# EAGLE board MakerBot_MightyBoard_REVE (EAGLE 5.11), part 1 of 2
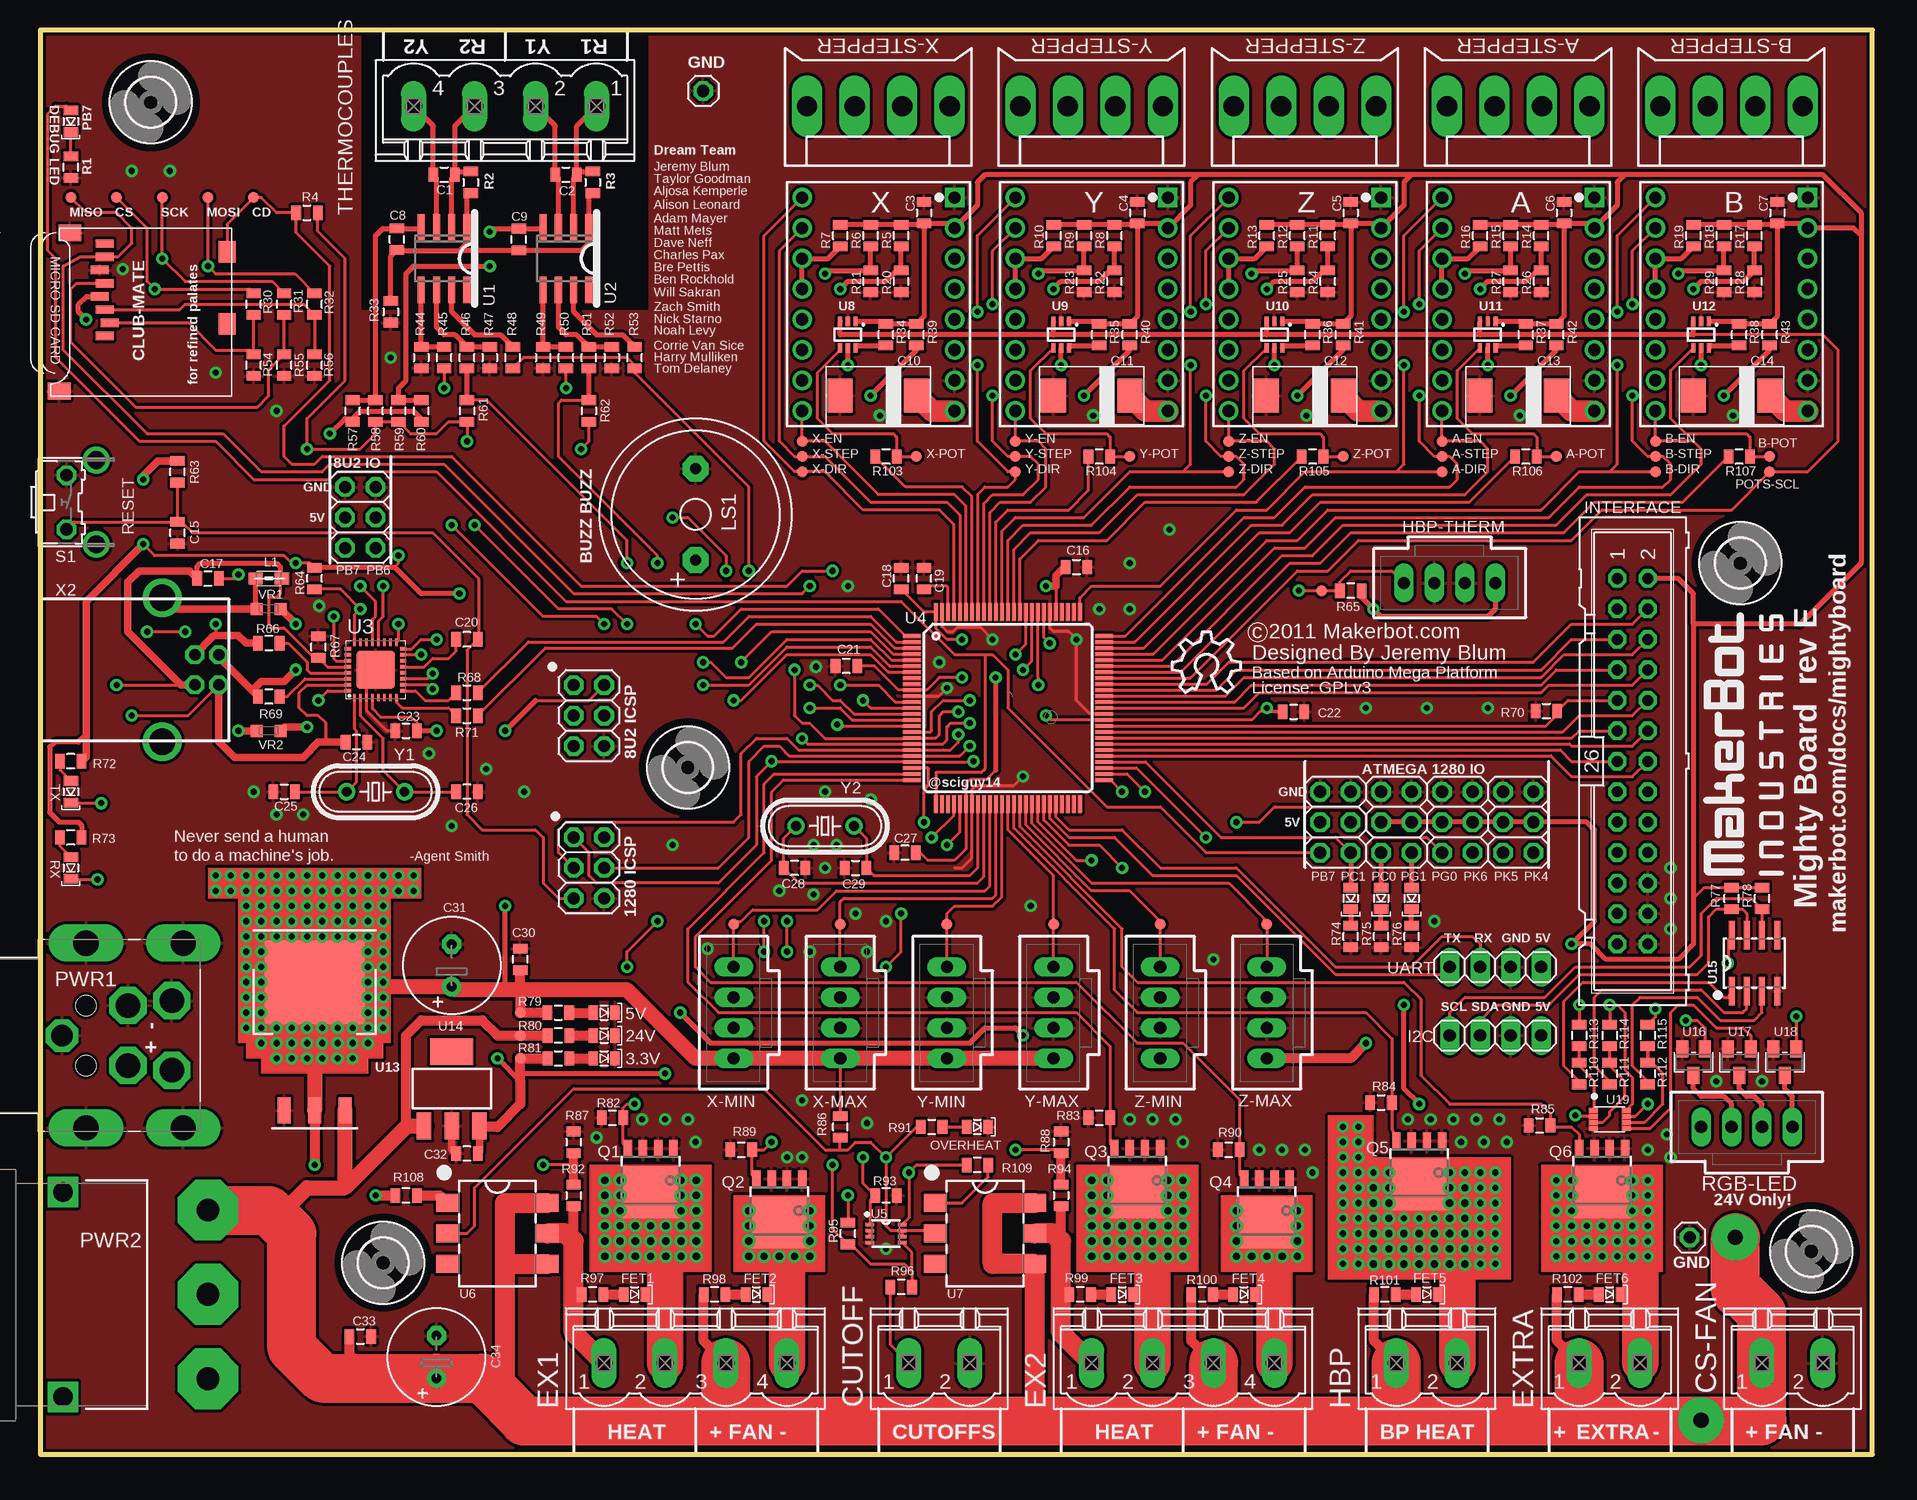
[diagram p2: board, top side]
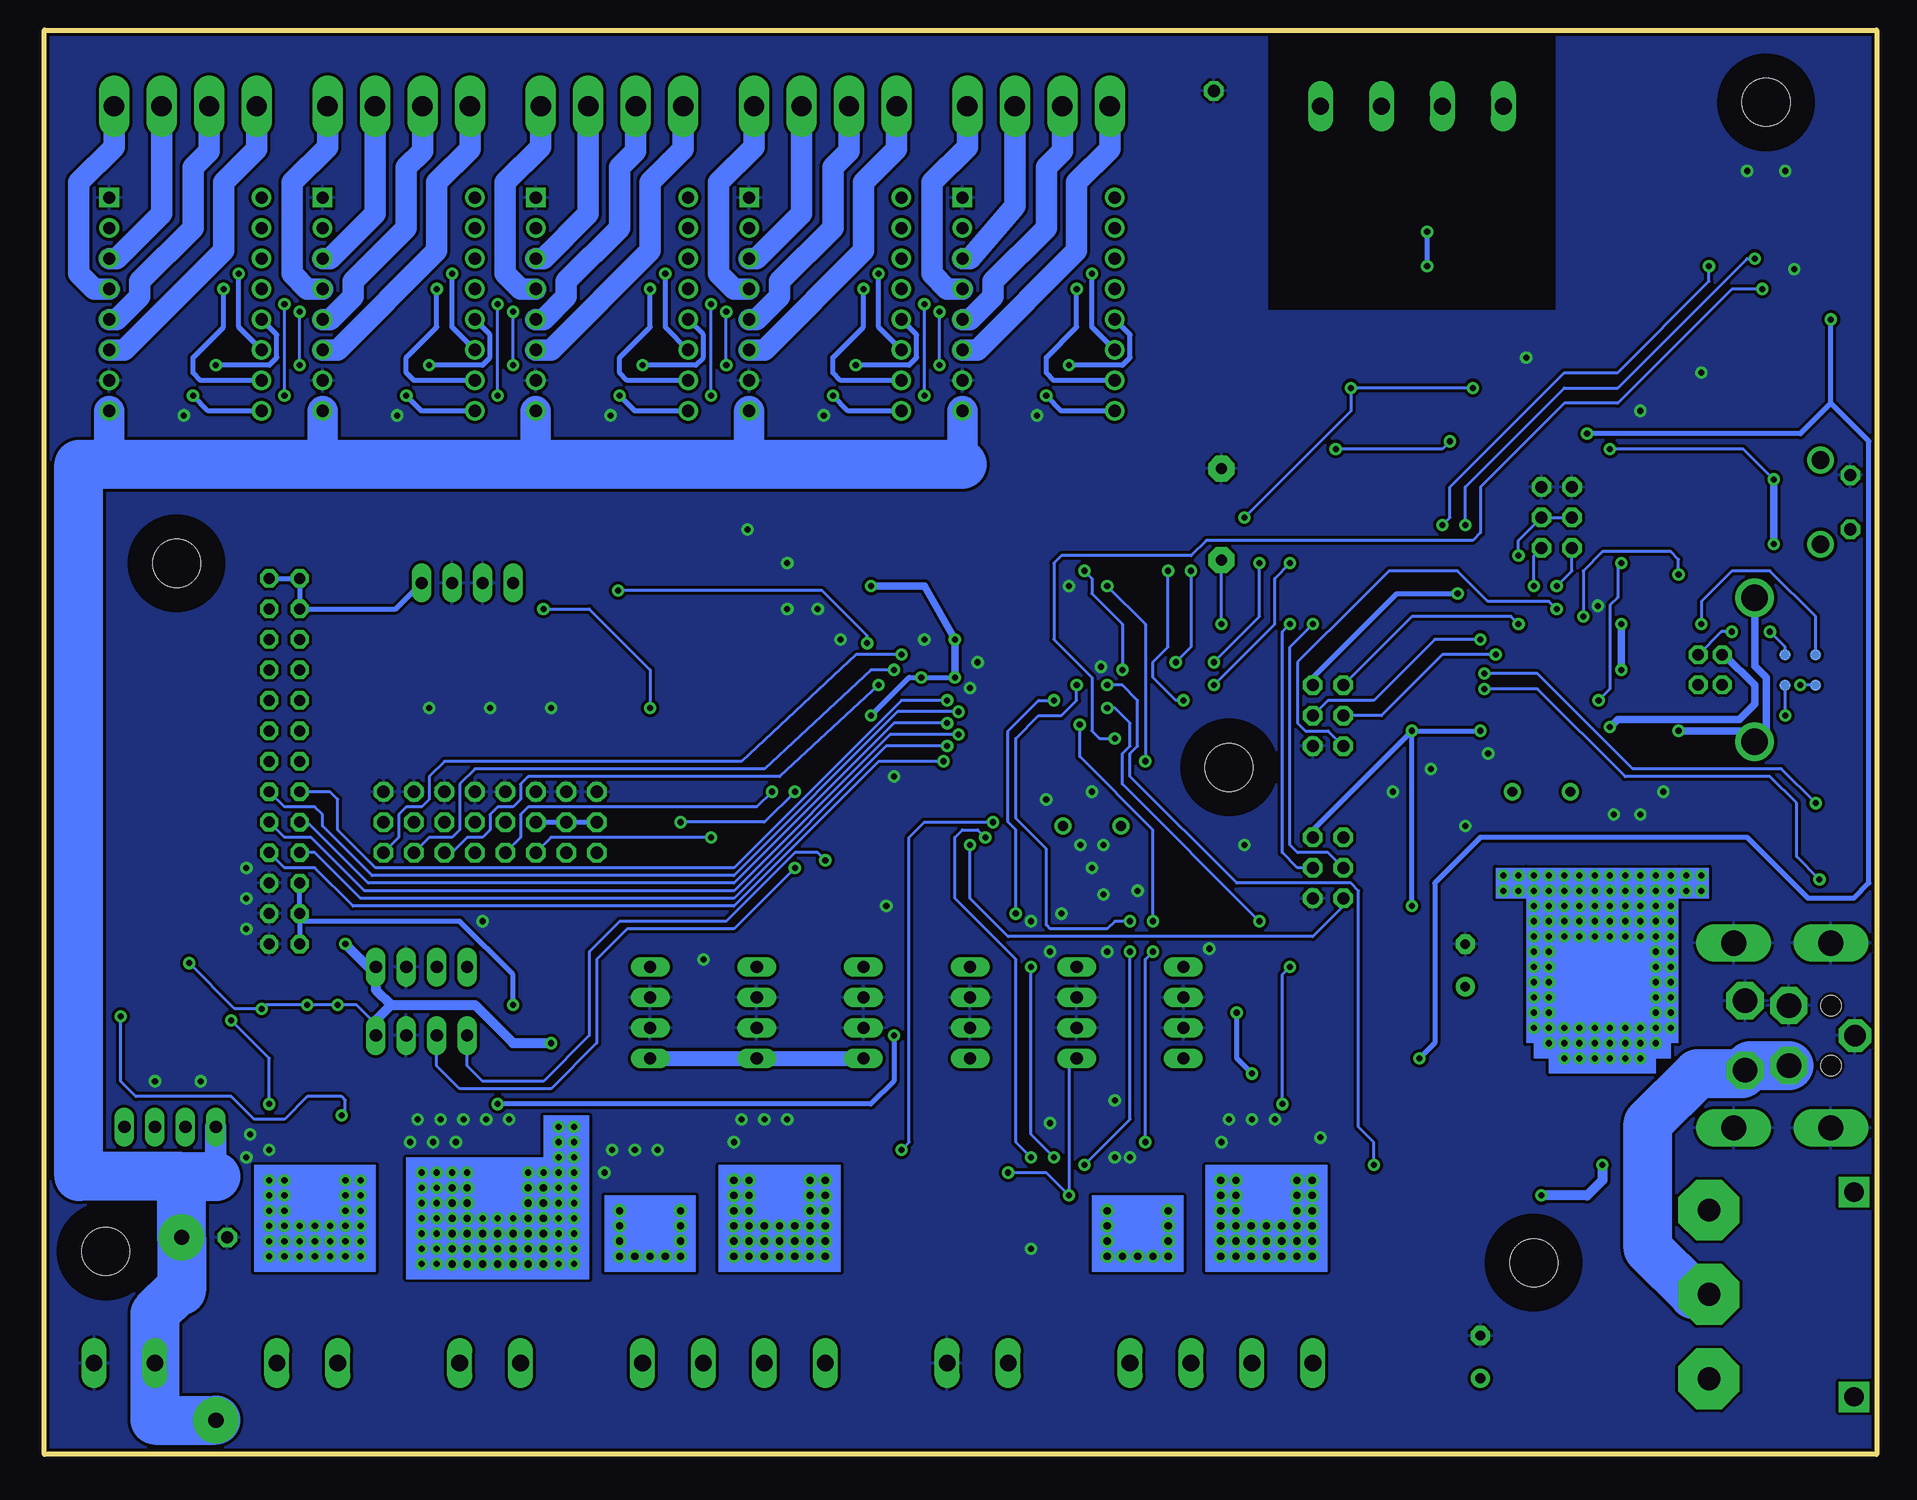
[diagram p3: board, bottom side, seen from below]

Size 152.72 x 118.75 mm. Coordinates in mm from the lower left corner, seen from the top.
Outline: 0,0 152.72,0 152.72,118.75 0,118.75 0,0
Copper layers (1*16): Top 0.035mm / dielectric 1.5mm / Bottom 0.035mm
Design rules "SparkFun *": minimum track width 8mil, minimum drill 20mil, track to track 8mil, track to pad 8mil, pad to pad 8mil, via to via 8mil, smd to smd 0mil, copper to edge 10mil, drill to drill 8mil, minimum pad ring 12mil, minimum via ring 10mil, stop-mask expansion 4mil, vias tented up to drill 25mil, thermal gap 10mil
Net classes: 0 default: width 0.203 mm, drill 0.508 mm, clearance 0.203 mm; 1 24V: width 0.889 mm, drill 0.635 mm, clearance 0.508 mm; 2 gnd: width 0.381 mm, drill 0.508 mm, clearance 0.254 mm; 3 5V: width 0.381 mm, drill 0.508 mm, clearance 0.254 mm; 4 3.3V: width 0.381 mm, drill 0.508 mm, clearance 0.254 mm; 5 DC Motor: width 0.762 mm, drill 0.635 mm, clearance 0.254 mm

## Footprints (pad centres in the part's own frame; a part is rotated, then mirrored left to right if it is on the bottom)
LED-0805 = smd 1.2 x 0.8: A 0,-0.9; C 0,0.9
4,0HOLE-3,0KEEPOUT = hole 4: 0,0
TP09R = smd 0.9 x 0.9: TP 0,0
KK-156-4 = drill 1.7 pad 2.184 long: 1 -5.94,0; 2 -1.98,0; 3 1.98,0; 4 5.94,0
BOTSTEP17-INV = drill 1.016 square: 1 6.35,8.89 | drill 1.016 round: 2 6.35,6.35; 3 6.35,3.81; 4 6.35,1.27; 5 6.35,-1.27; 6 6.35,-3.81; 7 6.35,-6.35; 8 6.35,-8.89; 9 -6.35,-8.89; 10 -6.35,-6.35; 11 -6.35,-3.81; 12 -6.35,-1.27; 13 -6.35,1.27; 14 -6.35,3.81; 15 -6.35,6.35; 16 -6.35,8.89
0805 = smd 0.8 x 1.2: 1 -0.9,0; 2 0.9,0
CAP2917 = smd 2.1 x 2.8: 1 -3.2,0; 2 3.2,0
E3,5-8 = drill 0.813 pad 1.6 round: + -1.778,0 | drill 0.813 pad 1.6 octagon: - 1.778,0
MSTBV2 = drill 1.397 long: 1 -2.54,0; 2 2.54,0
MSTBV4 = drill 1.397 long: 1 -7.62,0; 2 -2.54,0; 3 2.54,0; 4 7.62,0
70543-04 = drill 1.016 long: 1 -3.81,0; 2 -1.27,0; 3 1.27,0; 4 3.81,0
1X04 = drill 1.016 long: 1 -3.81,0; 2 -1.27,0; 3 1.27,0; 4 3.81,0
2X03 = drill 1.016 octagon: 1 -2.54,-1.27; 2 -2.54,1.27; 3 0,-1.27; 4 0,1.27; 5 2.54,-1.27; 6 2.54,1.27
ML26 = drill 0.914 octagon: 1 -15.24,-1.27; 2 -15.24,1.27; 3 -12.7,-1.27; 4 -12.7,1.27; 5 -10.16,-1.27; 6 -10.16,1.27; 7 -7.62,-1.27; 8 -7.62,1.27; 9 -5.08,-1.27; 10 -5.08,1.27; 11 -2.54,-1.27; 12 -2.54,1.27; 13 0,-1.27; 14 0,1.27; 15 2.54,-1.27; 16 2.54,1.27; 17 5.08,-1.27; 18 5.08,1.27; 19 7.62,-1.27; 20 7.62,1.27; 21 10.16,-1.27; 22 10.16,1.27; 23 12.7,-1.27; 24 12.7,1.27; 25 15.24,-1.27; 26 15.24,1.27
1X01 = drill 1.016 octagon: 1 0,0
0805' = smd 1.2 x 1: 1 -1.1,0; 2 1.1,0
F/QMB = drill 0.914 pad 2.159 octagon: + 3.81,0; - -3.81,0
MICROSD = smd 0.7 x 1.5: 1 9,-10.64; 2 7.9,-10.24; 3 6.8,-10.64; 4 5.7,-11.04; 5 4.6,-10.64; 6 3.5,-11.04; 7 2.4,-10.64; 8 1.3,-10.64 | smd 1.8 x 1.4: CD1 2,-0.44; CD2 8,-0.44 | smd 1.4 x 1.9: MT1 0.4,-13.54; MT2 13.6,-14.44
JPJX-4S-S = drill 2.05 pad 3.1 octagon: 1 2.9,-7.15; 2 -2.9,-7.15; 3 2.5,-3.5; 4 -2.5,-3.5 | drill 2.1 long: CASE1 -7.7,0; CASE2 -7.7,-8.1; CASE3 7.7,-8.1; CASE4 7.7,0 | drill 1.8 pad 2.286 octagon: SHLD 0,2 | hole 1.7: -2.5,0; 2.5,0
D501JT2S2APQF = drill 1.905 pad 5.08 octagon: 1 0,0; 1A 0,7.036; 1B 0,-7.036 | drill 1.6 pad 2.54 square: SLD1 -12.09,8.534; SLD2 -12.09,-8.534
SOT669 = smd 0.7 x 1.4: 1 -1.905,-3.92; 2 -0.635,-3.92; 3 0.635,-3.92; 4 1.905,-3.92 | smd 5 x 4.3: MB 0,-0.27
B3F-31XX = drill 1.016 octagon: 1 -2.261,-1.245; 2 2.261,-1.245 | drill 1.499 pad 2.159 round: 3 -3.505,1.245; 4 3.505,1.245
SO08 = smd 0.6 x 2.2: 1 -1.905,-2.6; 2 -0.635,-2.6; 3 0.635,-2.6; 4 1.905,-2.6; 5 1.905,2.6; 6 0.635,2.6; 7 -0.635,2.6; 8 -1.905,2.6
QFN32 = smd 0.6 x 0.3: 1 -2.3,1.75; 2 -2.3,1.25; 3 -2.3,0.75; 4 -2.3,0.25; 5 -2.3,-0.25; 6 -2.3,-0.75; 7 -2.3,-1.25; 8 -2.3,-1.75; 17 2.3,-1.75; 18 2.3,-1.25; 19 2.3,-0.75; 20 2.3,-0.25; 21 2.3,0.25; 22 2.3,0.75; 23 2.3,1.25; 24 2.3,1.75 | smd 0.3 x 0.6: 9 -1.75,-2.3; 10 -1.25,-2.3; 11 -0.75,-2.3; 12 -0.25,-2.3; 13 0.25,-2.3; 14 0.75,-2.3; 15 1.25,-2.3; 16 1.75,-2.3; 25 1.75,2.3; 26 1.25,2.3; 27 0.75,2.3; 28 0.25,2.3; 29 -0.25,2.3; 30 -0.75,2.3; 31 -1.25,2.3; 32 -1.75,2.3 | smd 3.2 x 3.2: EXP 0,0
TQFP100 = smd 1.5 x 0.35: 1 -8,6; 2 -8,5.5; 3 -8,5; 4 -8,4.5; 5 -8,4; 6 -8,3.5; 7 -8,3; 8 -8,2.5; 9 -8,2; 10 -8,1.5; 11 -8,1; 12 -8,0.5; 13 -8,0; 14 -8,-0.5; 15 -8,-1; 16 -8,-1.5; 17 -8,-2; 18 -8,-2.5; 19 -8,-3; 20 -8,-3.5; 21 -8,-4; 22 -8,-4.5; 23 -8,-5; 24 -8,-5.5; 25 -8,-6; 51 8,-6; 52 8,-5.5; 53 8,-5; 54 8,-4.5; 55 8,-4; 56 8,-3.5; 57 8,-3; 58 8,-2.5; 59 8,-2; 60 8,-1.5; 61 8,-1; 62 8,-0.5; 63 8,0; 64 8,0.5; 65 8,1; 66 8,1.5; 67 8,2; 68 8,2.5; 69 8,3; 70 8,3.5; 71 8,4; 72 8,4.5; 73 8,5; 74 8,5.5; 75 8,6 | smd 0.35 x 1.5: 26 -6,-8; 27 -5.5,-8; 28 -5,-8; 29 -4.5,-8; 30 -4,-8; 31 -3.5,-8; 32 -3,-8; 33 -2.5,-8; 34 -2,-8; 35 -1.5,-8; 36 -1,-8; 37 -0.5,-8; 38 0,-8; 39 0.5,-8; 40 1,-8; 41 1.5,-8; 42 2,-8; 43 2.5,-8; 44 3,-8; 45 3.5,-8; 46 4,-8; 47 4.5,-8; 48 5,-8; 49 5.5,-8; 50 6,-8; 76 6,8; 77 5.5,8; 78 5,8; 79 4.5,8; 80 4,8; 81 3.5,8; 82 3,8; 83 2.5,8; 84 2,8; 85 1.5,8; 86 1,8; 87 0.5,8; 88 0,8; 89 -0.5,8; 90 -1,8; 91 -1.5,8; 92 -2,8; 93 -2.5,8; 94 -3,8; 95 -3.5,8; 96 -4,8; 97 -4.5,8; 98 -5,8; 99 -5.5,8; 100 -6,8
US8 = smd 0.3 x 0.7: 1 -0.75,-1.35; 2 -0.25,-1.35; 3 0.25,-1.35; 4 0.75,-1.35; 5 0.75,1.35; 6 0.25,1.35; 7 -0.25,1.35; 8 -0.75,1.35
AQV25-DIPSM = smd 1.5 x 1.9: 1 -2.54,-4.15; 2 0,-4.15; 3 2.54,-4.15; 4 2.54,4.15; 5 0,4.15; 6 -2.54,4.15
SC70-6L = smd 0.35 x 0.8: 1 -0.65,-1.1; 2 0,-1.1; 3 0.65,-1.1; 4 0.65,1.1; 5 0,1.1; 6 -0.65,1.1
TO-263 = smd 2.184 x 1.067: 1 10.681,-2.54; 2 10.681,0; 3 10.681,2.54 | smd 6.985 x 8.331: TAB 0,0
SOT223 = smd 1.219 x 2.235: 1 -2.311,-3.099; 2 0,-3.099; 3 2.311,-3.099 | smd 3.6 x 2.2: 4 0,3.099
SO8 = smd 0.5 x 2.388: 1 -1.905,-2.324; 2 -0.635,-2.324; 3 0.635,-2.324; 4 1.905,-2.324; 5 1.905,2.324; 6 0.635,2.324; 7 -0.635,2.324; 8 -1.905,2.324
SOT-23 = smd 1 x 1.4: 1 -0.95,-1.1; 2 0.95,-1.1; 3 0,1.1
VSSOP8 = smd 0.4 x 0.75: 1 -0.75,-1.375; 2 -0.25,-1.375; 3 0.25,-1.375; 4 0.75,-1.375; 5 0.75,1.375; 6 0.25,1.375; 7 -0.25,1.375; 8 -0.75,1.375
CT/CN0603 = smd 1 x 1: 1 -1,0; 2 1,0
SMARTPRJ_PN61729 = drill 0.95 octagon: 1 1.25,4.71; 2 -1.25,4.71; 3 -1.25,2.71; 4 1.25,2.71 | drill 2.2 round: P$1 -6,0; P$2 6,0
HC49/S = drill 0.813 round: 1 -2.413,0; 2 2.413,0

## Placement (x,y rotation side)
3.3V  GREEN  [LED-0805]  46.99,33.02 270 top
5V  GREEN  [LED-0805]  46.99,36.83 270 top
24V  GREEN  [LED-0805]  46.99,34.92 270 top
$$$$$$U$1  [4,0HOLE-3,0KEEPOUT]  28.57,15.98 0 top
$$U$1  [4,0HOLE-3,0KEEPOUT]  147.61,16.93 0 top
$$U$7  [4,0HOLE-3,0KEEPOUT]  141.7,74.3 0 top
$$U$8  [4,0HOLE-3,0KEEPOUT]  53.98,57.28 0 top
A-DIR  TPSQTP09R  [TP09R]  116.84,81.92 0 top
A-EN  TPSQTP09R  [TP09R]  116.84,84.45 0 top
A-POT  TPSQTP09R  [TP09R]  126.36,83.19 0 top
A-STEP  TPSQTP09R  [TP09R]  116.84,83.19 0 top
A-STEPPER  [KK-156-4]  123.19,112.39 180 top
B-DIR  TPSQTP09R  [TP09R]  134.62,81.92 0 top
B-EN  TPSQTP09R  [TP09R]  134.62,84.45 0 top
B-POT  TPSQTP09R  [TP09R]  144.15,83.19 0 top
B-STEP  TPSQTP09R  [TP09R]  134.62,83.19 0 top
B-STEPPER  [KK-156-4]  140.97,112.39 180 top
BOTSTEP-A  BOTSTEP17  [BOTSTEP17-INV]  123.19,95.89 0 top
BOTSTEP-B  BOTSTEP17  [BOTSTEP17-INV]  140.97,95.89 0 top
BOTSTEP-X  BOTSTEP17  [BOTSTEP17-INV]  69.85,95.89 0 top
BOTSTEP-Y  BOTSTEP17  [BOTSTEP17-INV]  87.63,95.89 0 top
BOTSTEP-Z  BOTSTEP17  [BOTSTEP17-INV]  105.41,95.89 0 top
C1  100nF  [0805]  33.66,106.68 0 top
C2  100nF  [0805]  43.81,106.68 0 top
C3  100nF  [0805]  73.66,103.5 270 top
C4  100nF  [0805]  91.44,103.5 270 top
C5  100nF  [0805]  109.22,103.5 270 top
C6  100nF  [0805]  127,103.5 270 top
C7  100nF  [0805]  144.78,103.5 270 top
C8  100nF  [0805]  29.72,101.3 90 top
C9  100nF  [0805]  39.88,101.28 90 top
C10  47uF  [CAP2917]  69.85,88.27 180 top
C11  47uF  [CAP2917]  87.63,88.27 180 top
C12  47uF  [CAP2917]  105.41,88.27 180 top
C13  47uF  [CAP2917]  123.19,88.27 180 top
C14  47uF  [CAP2917]  140.97,88.27 180 top
C15  22pF  [0805]  11.43,76.83 90 top
C16  100nF  [0805]  86.36,73.98 0 top
C17  1uF  [0805]  13.97,73.03 0 top
C18  100nF  [0805]  71.75,73.03 90 top
C19  100nF  [0805]  73.66,73.03 90 top
C20  100nF  [0805]  35.56,67.94 180 top
C21  100nF  [0805]  67.18,65.72 180 top
C22  100nF  [0805]  104.46,61.91 0 top
C23  100nF  [0805]  30.48,60.33 0 top
C24  100nF  [0805]  26.35,59.37 180 top
C25  22pF  [0805]  20.32,55.24 0 top
C26  22pF  [0805]  35.56,55.24 180 top
C27  100nF  [0805]  72.07,50.16 180 top
C28  22pF  [0805]  62.87,48.9 180 top
C29  22pF  [0805]  67.94,48.9 0 top
C30  100nF  [0805]  40.01,41.27 90 top
C31  100uF  [E3,5-8]  34.29,40.77 90 top
C32  100nF  [0805]  35.56,25.08 180 top
C33  100nF  [0805]  26.67,9.84 0 top
C34  100uF  [E3,5-8]  33.02,8.13 90 top
CD  TPSQTP09R  [TP09R]  17.78,104.78 0 top
CS  TPSQTP09R  [TP09R]  6.35,104.78 0 top
CS-FAN  MSTBV2  [MSTBV2]  146.05,7.62 0 top
CUTOFF  MSTBV2  [MSTBV2]  74.93,7.62 0 top
DEBUG1  GREEN  [LED-0805]  2.54,111.12 180 top
DEBUG2  GREEN  [LED-0805]  109.22,46.35 180 top
DEBUG3  GREEN  [LED-0805]  111.76,46.35 180 top
DEBUG4  GREEN  [LED-0805]  114.3,46.35 180 top
EX1  MSTBV4  [MSTBV4]  54.61,7.62 0 top
EX2  MSTBV4  [MSTBV4]  95.25,7.62 0 top
EXTRA  MSTBV2  [MSTBV2]  130.81,7.62 0 top
FET1  GREEN  [LED-0805]  49.53,13.34 270 top
FET2  GREEN  [LED-0805]  59.69,13.34 270 top
FET3  GREEN  [LED-0805]  90.17,13.34 270 top
FET4  GREEN  [LED-0805]  100.33,13.34 270 top
FET5  GREEN  [LED-0805]  115.57,13.34 270 top
FET6  GREEN  [LED-0805]  130.81,13.34 270 top
HBP  MSTBV2  [MSTBV2]  115.57,7.62 0 top
HBP-THERM  C-GRID-04-70543  [70543-04]  117.47,72.64 180 top
I2C  DNP  [1X04]  121.28,34.92 180 top
ICSP1  8U2-ICSP-DNP  [2X03]  45.72,61.59 270 top
ICSP2  ATMEGA-ICSP-DNP  [2X03]  45.72,48.9 270 top
INTERFACE  [ML26]  132.72,57.78 270 top
JP2  DNP  [1X01]  55.24,113.67 0 top
JP3  DNP  [2X03]  26.67,78.11 270 top
JP4  DNP  [2X03]  107.95,52.7 270 top
JP5  DNP  [2X03]  113.03,52.7 270 top
JP6  DNP  [2X03]  118.11,52.7 270 top
JP7  DNP  [2X03]  123.19,52.7 270 top
JP8  DNP  [1X01]  137.48,18.1 0 top
L1  BLM21  [0805']  19.05,73.03 180 top
LOGO1  MAKERBOTNAME  [MAKERBOTNAME1]  145.54,47.69 90 top
LOGO2  OSHW_LOGO_10MILX0200-NT  [OSHW_10X200_NOTEXT]  94.36,63.5 0 top
LS1  F/QMB  [F/QMB]  54.61,78.36 270 top
MISO  TPSQTP09R  [TP09R]  2.54,104.78 0 top
MOSI  TPSQTP09R  [TP09R]  13.97,104.78 0 top
MP1  DNP  [MICROSD]  16,102.23 270 top
OVERHEAT  RED  [LED-0805]  78.11,27.3 270 top
POTS-SCL  TPSQTP09R  [TP09R]  144.15,81.92 0 top
PWR1  KPJX-4S-S  [JPJX-4S-S]  3.81,34.92 90 top
PWR2  PWRSWITCH  [D501JT2S2APQF]  13.97,13.34 0 top
Q1  PSMN7R0-30YL  [SOT669]  50.86,21.59 180 top
Q2  PSMN7R0-30YL  [SOT669]  61.59,19.05 180 top
Q3  PSMN7R0-30YL  [SOT669]  91.44,21.59 180 top
Q4  PSMN7R0-30YL  [SOT669]  102.23,19.05 180 top
Q5  PSMN7R0-30YL  [SOT669]  114.94,22.23 180 top
Q6  PSMN7R0-30YL  [SOT669]  130.18,21.59 180 top
R1  1K  [0805]  2.54,107.31 90 top
R2  0  [0805]  35.88,106.05 270 top
R3  0  [0805]  46.04,106.05 270 top
R4  DNP  [0805]  22.23,103.5 0 top
R5  0  [0805]  71.75,101.6 90 top
R6  0  [0805]  69.22,101.6 90 top
R7  10K  [0805]  66.67,101.6 90 top
R8  0  [0805]  89.53,101.6 90 top
R9  0  [0805]  87,101.6 90 top
R10  10K  [0805]  84.45,101.6 90 top
R11  0  [0805]  107.31,101.6 90 top
R12  0  [0805]  104.78,101.6 90 top
R13  10K  [0805]  102.23,101.6 90 top
R14  0  [0805]  125.09,101.6 90 top
R15  0  [0805]  122.56,101.6 90 top
R16  10K  [0805]  120.02,101.6 90 top
R17  0  [0805]  142.88,101.6 90 top
R18  0  [0805]  140.34,101.6 90 top
R19  10K  [0805]  137.79,101.6 90 top
R20  DNP  [0805]  71.75,97.79 90 top
R21  DNP  [0805]  69.22,97.79 90 top
R22  DNP  [0805]  89.53,97.79 90 top
R23  DNP  [0805]  87,97.79 90 top
R24  DNP  [0805]  107.31,97.79 90 top
R25  DNP  [0805]  104.78,97.79 90 top
R26  DNP  [0805]  125.09,97.79 90 top
R27  DNP  [0805]  122.56,97.79 90 top
R28  DNP  [0805]  142.88,97.79 90 top
R29  DNP  [0805]  140.34,97.79 90 top
R30  DNP  [0805]  17.78,95.89 90 top
R31  DNP  [0805]  20.32,95.89 90 top
R32  DNP  [0805]  22.86,95.89 90 top
R33  0  [0805]  29.21,95.25 270 top
R34  10K  [0805]  70.48,93.34 90 top
R35  10K  [0805]  88.27,93.34 90 top
R36  10K  [0805]  106.05,93.34 90 top
R37  10K  [0805]  123.83,93.34 90 top
R38  10K  [0805]  141.6,93.34 90 top
R39  4.7K  [0805]  73.03,93.34 90 top
R40  4.7K  [0805]  90.81,93.34 90 top
R41  4.7K  [0805]  108.58,93.34 90 top
R42  4.7K  [0805]  126.36,93.34 90 top
R43  4.7K  [0805]  144.15,93.34 90 top
R44  DNP  [0805]  31.75,91.44 270 top
R45  0  [0805]  33.66,91.44 90 top
R46  0  [0805]  35.56,91.44 90 top
R47  DNP  [0805]  37.47,91.44 270 top
R48  4.7K  [0805]  39.37,91.44 90 top
R49  DNP  [0805]  41.91,91.44 270 top
R50  0  [0805]  43.81,91.44 90 top
R51  0  [0805]  45.72,91.44 90 top
R52  DNP  [0805]  47.62,91.44 270 top
R53  4.7K  [0805]  49.53,91.44 90 top
R54  DNP  [0805]  17.78,90.81 90 top
R55  DNP  [0805]  20.32,90.81 90 top
R56  DNP  [0805]  22.86,90.81 90 top
R57  DNP  [0805]  26.04,87 90 top
R58  0  [0805]  27.94,87 90 top
R59  0  [0805]  29.84,87 90 top
R60  DNP  [0805]  31.75,87 90 top
R61  10K  [0805]  35.56,87 270 top
R62  10K  [0805]  45.72,87 270 top
R63  10K  [0805]  11.43,81.92 90 top
R64  10K  [0805]  22.86,73.03 90 top
R65  100K  [0805]  109.22,72.01 180 top
R66  22  [0805]  19.05,67.63 180 top
R67  0  [0805]  23.18,67.31 90 top
R68  1K  [0805]  35.56,63.5 0 top
R69  22  [0805]  19.05,63.18 180 top
R70  10K  [0805]  125.54,61.98 0 top
R71  1K  [0805]  35.56,61.59 0 top
R72  1K  [0805]  2.54,57.78 180 top
R73  1K  [0805]  2.54,51.44 180 top
R74  1K  [0805]  109.22,43.18 90 top
R75  1K  [0805]  111.76,43.18 90 top
R76  1K  [0805]  114.3,43.18 90 top
R77  4.7K  [0805]  140.97,46.35 90 top
R78  4.7K  [0805]  143.51,46.35 90 top
R79  1K  [0805]  43.18,36.83 0 top
R80  2.21K  [0805]  43.18,34.92 180 top
R81  1K  [0805]  43.18,33.02 0 top
R82  4.7K  [0805]  47.69,28.07 0 top
R83  4.7K  [0805]  88.27,28.07 0 top
R84  4.7K  [0805]  111.76,29.34 0 top
R85  4.7K  [0805]  124.97,27.43 0 top
R86  10k  [0805]  66.67,27.3 90 top
R87  2.21K  [0805]  44.45,26.04 270 top
R88  2.21K  [0805]  85.09,26.04 270 top
R89  4.7K  [0805]  58.42,25.4 0 top
R90  4.7K  [0805]  99.06,25.4 0 top
R91  1K  [0805]  74.3,27.3 0 top
R92  10k  [0805]  44.45,21.59 270 top
R93  10k  [0805]  70.48,21.59 180 top
R94  10k  [0805]  85.09,21.59 270 top
R95  10k  [0805]  67.31,18.41 90 top
R96  499  [0805]  71.75,13.97 180 top
R97  2.21K  [0805]  46.04,13.34 180 top
R98  2.21K  [0805]  56.2,13.34 180 top
R99  2.21K  [0805]  86.68,13.34 180 top
R100  2.21K  [0805]  96.84,13.34 180 top
R101  2.21K  [0805]  112.08,13.34 180 top
R102  2.21K  [0805]  127.32,13.34 180 top
R103  1K  [0805]  70.48,83.19 180 top
R104  1K  [0805]  88.27,83.19 180 top
R105  1K  [0805]  106.05,83.19 180 top
R106  1K  [0805]  123.83,83.19 180 top
R107  1K  [0805]  141.6,83.19 180 top
R108  4.7K  [0805]  30.48,21.59 180 top
R109  4.7K  [0805]  78.11,24.13 180 top
R110  100K  [0805]  128.27,31.75 270 top
R111  100K  [0805]  130.81,31.75 270 top
R112  100K  [0805]  133.99,31.75 270 top
R113  1M  [0805]  128.27,34.92 270 top
R114  1M  [0805]  130.81,34.92 270 top
R115  1M  [0805]  133.99,34.92 270 top
RGB-LED  C-GRID-04-70543  [70543-04]  142.24,27.3 0 top
RX  GREEN  [LED-0805]  2.54,48.9 180 top
S1  [B3F-31XX]  3.43,79.38 270 top
SCK  TPSQTP09R  [TP09R]  10.16,104.78 0 top
TP27  TPSQTP09R  [TP09R]  106.81,72.01 0 top
TP28  TPSQTP09R  [TP09R]  57.78,44.2 0 top
TP29  TPSQTP09R  [TP09R]  66.67,44.2 0 top
TP30  TPSQTP09R  [TP09R]  75.56,44.2 0 top
TP31  TPSQTP09R  [TP09R]  84.45,44.2 0 top
TP32  TPSQTP09R  [TP09R]  93.34,44.2 0 top
TP33  TPSQTP09R  [TP09R]  102.23,44.2 0 top
TP34  TPSQTP09R  [TP09R]  40.01,36.83 90 top
TP35  TPSQTP09R  [TP09R]  40.01,34.92 90 top
TP36  TPSQTP09R  [TP09R]  40.01,33.02 90 top
TX  GREEN  [LED-0805]  2.54,55.24 180 top
U1  MAX6675  [SO08]  33.66,99.69 180 top
U2  MAX6675  [SO08]  43.81,99.69 180 top
U3  ATMEGA8U2-MU  [QFN32]  27.94,65.41 90 top
U4  ATMEGA1280-16AU  [TQFP100]  80.64,62.23 0 top
U5  NC7WZ02  [US8]  70.48,18.41 270 top
U6  AQV25  [AQV25-DIPSM]  38.1,18.41 270 top
U7  AQV25  [AQV25-DIPSM]  78.74,18.41 270 top
U8  MCP4018  [SC70-6L]  67.31,93.34 180 top
U9  MCP4018  [SC70-6L]  85.09,93.34 180 top
U10  MCP4018  [SC70-6L]  102.87,93.34 180 top
U11  MCP4018  [SC70-6L]  120.65,93.34 180 top
U12  MCP4018  [SC70-6L]  138.43,93.34 180 top
U13  LM1084-5V  [TO-263]  22.86,39.37 270 top
U14  V_REG_MIC2920  [SOT223]  34.29,30.48 0 top
U15  PCA9533  [SO8]  142.88,40.96 0 top
U16  FDV301N  [SOT-23]  137.79,32.7 180 top
U17  FDV301N  [SOT-23]  141.6,32.7 180 top
U18  FDV301N  [SOT-23]  145.41,32.7 180 top
U19  74HC3G14DC  [VSSOP8]  130.81,27.94 270 top
U$1  [4,0HOLE-3,0KEEPOUT]  9.21,112.71 0 top
UART  DNP  [1X04]  121.28,40.64 180 top
UGND  TPSQTP09R  [TP09R]  5.08,64.14 0 bottom
USB+  TPSQTP09R  [TP09R]  5.08,66.67 0 bottom
USB-  TPSQTP09R  [TP09R]  7.62,66.67 0 bottom
UVCC  TPSQTP09R  [TP09R]  7.62,64.14 0 bottom
VR1  PGB1010604  [CT/CN0603]  19.05,70.48 0 top
VR2  PGB1010604  [CT/CN0603]  19.05,60.33 0 top
X1  MSTBV4  [MSTBV4]  38.73,112.39 180 top
X2  [SMARTPRJ_PN61729]  10.16,65.41 270 top
X-DIR  TPSQTP09R  [TP09R]  63.5,81.92 0 top
X-EN  TPSQTP09R  [TP09R]  63.5,84.45 0 top
X-MAX  C-GRID-04-70543  [70543-04]  66.67,36.83 90 top
X-MIN  C-GRID-04-70543  [70543-04]  57.78,36.83 90 top
X-POT  TPSQTP09R  [TP09R]  73.03,83.19 0 top
X-STEP  TPSQTP09R  [TP09R]  63.5,83.19 0 top
X-STEPPER  [KK-156-4]  69.85,112.39 180 top
Y1  16MHz  [HC49/S]  27.94,55.24 0 top
Y2  16MHz  [HC49/S]  65.41,52.39 0 top
Y-DIR  TPSQTP09R  [TP09R]  81.28,81.92 0 top
Y-EN  TPSQTP09R  [TP09R]  81.28,84.45 0 top
Y-MAX  C-GRID-04-70543  [70543-04]  84.45,36.83 90 top
Y-MIN  C-GRID-04-70543  [70543-04]  75.56,36.83 90 top
Y-POT  TPSQTP09R  [TP09R]  90.81,83.19 0 top
Y-STEP  TPSQTP09R  [TP09R]  81.28,83.19 0 top
Y-STEPPER  [KK-156-4]  87.63,112.39 180 top
Z-DIR  TPSQTP09R  [TP09R]  99.06,81.92 0 top
Z-EN  TPSQTP09R  [TP09R]  99.06,84.45 0 top
Z-MAX  C-GRID-04-70543  [70543-04]  102.23,36.83 90 top
Z-MIN  C-GRID-04-70543  [70543-04]  93.34,36.83 90 top
Z-POT  TPSQTP09R  [TP09R]  108.58,83.19 0 top
Z-STEP  TPSQTP09R  [TP09R]  99.06,83.19 0 top
Z-STEPPER  [KK-156-4]  105.41,112.39 180 top

## Tracks (layer width: path | path; a pad name or v marks a point on that pad's centre or on a via)
3.3V  (via drill 0.51)
  Top 0.406: MP1.4 3.83,96.53 3.17,95.89 3.17,95.25 v3.81,94.61 | v38.1,33.02 40.01,31.11 | R60.1 31.75,86.36 31.11,87 26.67,87 26.04,86.36 | 26.04,86.36 R57.1 | 26.04,86.36 25.4,86.36 v24.13,85.09 | v113.67,37.47 113.67,30.48 v114.94,29.21 | v81.92,34.92 81.28,35.56 78.74,35.56 77.47,34.29 55.88,34.29 v53.34,36.83 | 40.01,31.75 v52.07,31.75
  Top 0.61: U14.3 36.6,25.22 C32.1
  Top 0.813: R81.1 TP36.TP 40.01,31.75 40.01,31.11 40.01,29.21 38.1,27.3 36.68,27.3 U14.3
  Bottom 0.406: 3.81,87.63 v3.81,94.61 | 3.81,87.63 0.64,84.45 0.64,47.62 1.91,46.35 5.71,46.35 10.79,51.44 33.02,51.44 36.83,47.62 36.83,34.29 v38.1,33.02 | v24.13,85.09 6.35,85.09 3.81,87.63 | v114.94,29.21 83.82,29.21 81.92,31.11 v81.92,34.92 | v53.34,36.83 53.34,33.02 v52.07,31.75 | 131.44,44.45 INTERFACE.25 | 131.44,44.45 INTERFACE.23 INTERFACE.21 | v113.67,37.47 113.67,40.01 118.11,44.45 119.38,44.45 131.44,44.45
5V  (via drill 0.51)
  Top 0.254: U3.4 27.69,62.16 28.4,61.44 30.94,61.44 31.43,60.96 31.43,60.38 C23.2 | U3.32 23.97,63.66 v23.18,62.87 | R64.2 22.49,74.3 v21.27,74.3 20.95,74.3 20.32,74.93 9.53,74.93 v8.57,75.88 | U4.61 88.64,61.22 | U4.61 100.97,61.23 101.65,61.91 C22.1 102.55,61.91 v102.23,62.23 | X-MAX.1 R86.2 | 84.64,72.39 U4.80 | C27.1 73.34,50.16 73.98,49.53 76.2,49.53 77.14,50.48 U4.31 77.14,55.94 77.47,56.26 78.87,56.26 79.63,57.02 | C18.1 73.65,70.23 U4.100 74.64,68.86 75.56,67.94 v76.83,67.94 | C21.1 69.53,65.72 71.53,63.73 U4.10 73.89,63.73 74.93,64.77 v76.83,64.77 | v67.31,21.59 R95.2 | R78.2 R77.2 138.69,47.26 137.79,46.35 | R62.2 45.72,84.45 v45.09,83.82 | v35.56,84.45 R61.2 34.02,86.09 33.02,85.09 30.85,85.09 R59.1 R58.1 27.94,85.09 26.67,83.82 v22.23,83.82 22.23,86.36 25.4,89.53 25.4,99.69 23.12,101.97 R4.2 | ICSP1.2 45.72,62.87 41.27,62.87 | 29.58,73.92 29.58,74.03 29.84,74.3 v29.84,74.93 | U4.61 84.19,61.23 v83.82,61.59 | R109.2 73.03,24.13 v72.39,23.5 72.39,19.72 U5.8 | U15.8 140.75,42.96 140.75,41.06 v140.65,40.96 | v128.27,37.47 R113.1 | R114.1 v130.81,37.47 131.44,37.47 132.08,36.83 132.08,32.07 132.72,31.43 132.72,29.21 132.71,29.21 U19.8 | R115.1 134.62,36.46 v134.62,37.15
  Top 0.406: R73.1 3.44,52.44 3.17,52.7 1.59,52.7 0.76,53.53 0.76,58.99 1.27,59.37 3.17,59.37 3.81,60.01 | R65.1 110.12,71.49 v111.12,70.48 111.76,69.85 120.65,69.85 121.28,70.48 HBP-THERM.1 | JP7.4 128.91,52.7 129.54,52.07 129.54,44.45 v127.64,42.55 129.22,42.55 130.49,41.27 136.53,41.27 137.79,42.55 137.79,46.35 137.79,69.22 | JP7.4 JP7.3 | JP7.4 JP6.4 JP6.3 JP5.4 JP5.3 | 137.79,69.22 146.69,69.22 151.76,74.3 151.76,101.6 | 151.76,101.6 151.76,103.5 148.59,106.68 132.08,106.68 | v79.63,64.77 79.63,57.02 | v38.73,60.33 41.27,62.87 | v33.02,60.33 C23.2 | 38.73,38.73 v38.73,45.72 | v34.92,71.75 31.75,71.75 29.58,73.92 R64.2 | 137.79,69.22 137.79,71.75 136.53,73.03 INTERFACE.2 | R7.2 R6.2 R5.2 73.56,102.5 | 73.56,102.5 C3.2 75.83,102.61 BOTSTEP-X.2 78.11,104.14 78.11,106.05 78.74,106.68 96.52,106.68 | U8.1 70.28,94.44 R34.2 R39.2 73.66,94.88 73.66,102.23 73.56,102.34 73.56,102.5 | R10.2 R9.2 R8.2 91.33,102.5 C4.2 | C4.2 93.61,102.61 BOTSTEP-Y.2 95.89,104.14 95.89,106.05 96.52,106.68 | U9.1 88.06,94.44 R35.2 R40.2 91.44,94.88 C4.2 | 132.08,106.68 114.3,106.68 | 114.3,106.68 96.52,106.68 | R13.2 R12.2 R11.2 109.11,102.5 C5.2 | C5.2 111.39,102.61 BOTSTEP-Z.2 113.67,104.14 113.67,106.05 114.3,106.68 | C5.2 109.22,94.88 R41.2 R36.2 105.84,94.44 U10.1 | 132.08,106.68 131.44,106.05 131.44,104.14 BOTSTEP-A.2 129.17,102.61 C6.2 | 151.76,101.6 151.13,102.23 BOTSTEP-B.2 146.95,102.61 C7.2 | U11.1 123.62,94.44 R37.2 R42.2 127,94.88 C6.2 | C7.2 144.78,94.88 R43.2 R38.2 141.41,94.44 U12.1 | R16.2 R15.2 R14.2 126.89,102.5 C6.2 | R19.2 R18.2 R17.2 144.68,102.5 C7.2
  Top 0.61: v8.57,75.88 3.81,71.12 3.81,60.01 3.81,58.16 R72.1 | v8.57,81.28 8.57,81.6 9.79,82.81 R63.2 | v83.82,72.39 84.64,72.39 84.64,73.27 85.36,73.98 C16.1
  Top 0.813: R79.1 TP34.TP 40.01,38.73 C30.1 | U13.2 v22.86,24.13 | Z-MAX.1 109.22,33.02 v110.49,34.29 | v27.94,21.59 R108.2
  Top 1.27: U13.2 U13.TAB 23.24,38.99 C31.+ 34.54,38.73 38.73,38.73 40.01,38.73 48.9,38.73 54.61,33.02 X-MIN.1 X-MAX.1 Y-MIN.1 Y-MAX.1
  Bottom 0.254: v23.18,62.87 22.23,63.82 22.23,70.8 21.59,71.44 21.59,73.98 v21.27,74.3 | X-MAX.1 67.31,32.38 v67.31,21.59 69.22,23.5 v72.39,23.5 | v102.23,62.23 102.23,65.41 107.31,70.48 v111.12,70.48 | v45.09,83.82 36.2,83.82 v35.56,84.45 | v22.23,83.82 11.11,83.82 v8.57,81.28 | v29.84,74.93 29.84,76.2 JP3.4 JP3.3 | 125.09,35.88 126.68,37.47 v128.27,37.47 v130.81,37.47 134.3,37.47 v134.62,37.15 136.84,37.15 v140.65,40.96
  Bottom 0.406: HBP-THERM.1 123.44,70.48 INTERFACE.3 INTERFACE.1 INTERFACE.2 | JP5.3 JP4.4 JP4.3 | v76.83,64.77 v79.63,64.77 80.64,64.77 v83.82,61.59 | v38.73,60.33 v33.02,60.33 | ICSP2.2 46.99,52.07 v38.73,60.33 | v38.73,45.72 v38.73,60.33 | ICSP1.2 46.99,64.77 40.01,71.75 v34.92,71.75
  Bottom 0.61: v8.57,75.88 v8.57,81.28 | v83.82,72.39 79.38,72.39 v76.83,67.94 v76.83,64.77
  Bottom 0.813: v22.86,24.13 22.86,22.86 24.13,21.59 v27.94,21.59 | v110.49,34.29 113.67,34.29 116.84,37.47 123.83,37.47 | v127.64,42.55 125.73,40.64 UART.1 125.09,38.73 123.83,37.47 | I2C.1 125.09,35.88 125.09,36.2 123.83,37.47
  Bottom 1.27: Y-MAX.1 Z-MIN.1 Z-MAX.1
8U2-EX1  (via drill 0.51)
  Top 0.254: U3.21 27.69,69.6 27.94,69.85 27.94,71.12 v26.67,72.39
  Bottom 0.254: v26.67,72.39 25.4,73.66 JP3.5
8U2-EX2  (via drill 0.51)
  Top 0.254: U3.20 28.19,69.47 28.57,69.85 v28.57,72.39
  Bottom 0.254: v28.57,72.39 28.57,74.93 JP3.6
8U2-MISO  (via drill 0.51)
  Top 0.254: v29.84,69.22 29.84,67.86 U3.17
  Bottom 0.254: ICSP1.1 38.73,69.85 30.48,69.85 v29.84,69.22
8U2-MOSI  (via drill 0.51)
  Top 0.254: v33.02,67.94 31.75,67.94 30.96,67.16 U3.16
  Bottom 0.254: ICSP1.4 45.72,62.87 41.91,62.87 36.83,67.94 v33.02,67.94
8U2-RESET  (via drill 0.51)
  Top 0.254: U3.24 26.19,70 v26.67,70.48 25.03,72.12 R64.1
  Bottom 0.254: ICSP1.5 45.72,60.33 47.62,60.33 48.26,60.96 48.26,66.04 43.18,71.12 41.27,73.03 40.64,73.66 34.92,73.66 32.38,71.12 27.3,71.12 v26.67,70.48
8U2-SCK  (via drill 0.51)
  Top 0.254: v31.75,66.67 30.26,66.67 U3.15
  Bottom 0.254: ICSP1.3 41.27,61.59 36.2,66.67 v31.75,66.67
1280-EX1
  Top 0.254: JP4.6 107.95,51.44 98.42,51.44 92.13,57.73 U4.54
  Top 0.406: JP4.6 DEBUG2.A
1280-EX2  (via drill 0.51)
  Top 0.254: U4.53 91.36,57.23 v97.16,51.44
  Top 0.406: JP5.5 DEBUG3.A
  Bottom 0.254: v97.16,51.44 110.49,51.44 JP5.5
1280-EX3  (via drill 0.51)
  Top 0.254: U4.52 90.59,56.73 v92.08,55.24
  Top 0.406: JP5.6 DEBUG4.A
  Bottom 0.254: v92.08,55.24 93.34,53.98 112.39,53.98 113.03,53.34 113.03,51.44 JP5.6
1280-EX4  (via drill 0.51)
  Top 0.254: U4.51 89.19,56.23 v90.17,55.24 | v99.69,52.7 101.6,52.7 102.87,53.98 109.86,53.98 110.49,53.34 110.49,52.07 111.12,51.44 115.57,51.44 JP6.5
  Bottom 0.254: v90.17,55.24 92.71,52.7 v99.69,52.7
1280-EX5  (via drill 0.51)
  Top 0.254: U4.83 83.14,65.44 v83.19,64.14
  Bottom 0.254: JP6.6 118.75,50.16 117.47,51.44 116.2,51.44 115.57,52.07 115.57,53.34 114.94,53.98 113.67,53.98 113.03,54.61 113.03,55.88 112.39,56.52 91.44,56.52 v83.19,64.14
1280-EX6  (via drill 0.51)
  Top 0.254: U4.84 82.64,66.14 v81.92,65.41
  Bottom 0.254: JP7.5 120.65,51.44 118.75,51.44 118.11,52.07 118.11,55.88 116.84,57.15 92.71,57.15 83.82,65.41 v81.92,65.41
1280-EX7  (via drill 0.51)
  Top 0.254: U4.85 82.14,67.54 v81.28,66.67
  Bottom 0.254: JP7.6 123.19,51.44 123.19,53.34 122.56,53.98 121.28,53.98 120.65,54.61 120.65,56.52 119.38,57.78 94.61,57.78 85.09,66.67 v81.28,66.67
1280-EX-RX
  Top 0.254: U4.45 84.14,53.02 85.72,51.44 89.53,51.44 92.71,48.26 99.69,48.26 107.95,40.01 116.84,40.01 UART.4
1280-EX-TX
  Top 0.254: U4.46 84.64,53.15 85.72,52.07 90.17,52.07 93.34,48.9 99.69,48.9 107.95,40.64 114.3,40.64 116.84,43.18 119.38,43.18 120.02,42.55 UART.3
1280-MISO  (via drill 0.51)
  Top 0.254: MISO.TP 3.81,103.5 6.35,103.5 7.62,102.23 7.62,100.97 6.49,99.83 MP1.7 3.31,99.83 1.91,99.06 1.91,92.08 8.89,85.09 15.24,85.09 18.41,81.92 23.5,81.92 24.13,82.55 33.66,82.55 44.45,71.75 63.5,71.75 v64.14,72.39 | ICSP2.1 45.72,50.16 45.72,48.26 46.35,47.62 56.52,47.62 59.69,50.8 59.69,56.52 v60.96,57.78 72.59,57.78 U4.22 77.73,57.73 v77.79,57.78
  Bottom 0.254: v77.79,57.78 83.19,57.78 95.25,45.72 127,45.72 130.18,48.9 132.72,48.9 INTERFACE.20 | v64.14,72.39 60.96,69.22 v60.96,57.78
1280-MOSI  (via drill 0.51)
  Top 0.254: ICSP2.4 56.52,48.9 59.05,51.44 59.05,57.78 60.33,59.05 61.59,59.05 62.42,58.23 U4.21 76.64,58.23 v77.47,59.05 | MOSI.TP v13.97,99.06 14.61,98.42 21.22,98.42 R32.2 | v36.2,77.47 43.18,70.48 47.62,70.48 v48.9,69.22
  Bottom 0.254: v13.97,99.06 13.97,97.79 21.59,90.17 26.04,90.17 35.56,80.64 35.56,78.11 v36.2,77.47 | v48.9,69.22 49.53,68.58 49.53,50.16 48.26,48.9 ICSP2.4 | v77.47,59.05 82.55,59.05 95.25,46.35 126.36,46.35 130.18,50.16 INTERFACE.19
1280-RESET  (via drill 0.51)
  Top 0.254: C15.2 2.81,77.73 S1.2 | C15.2 R63.1 | ICSP2.5 43.18,46.35 41.91,47.62 41.91,51.44 41.27,52.07 36.83,52.07 35.56,53.34 35.56,67.05 C20.1 36.51,68 36.51,73.03 32.7,76.83 12.7,76.83 11.8,77.73 C15.2 | U4.30 76.64,51.88 v75.56,50.8
  Bottom 0.254: ICSP2.5 44.45,45.72 46.99,43.18 72.39,43.18 75.56,46.35 v75.56,50.8
1280-RX
  Top 0.254: U4.2 71.33,67.73 69.22,69.85 59.05,69.85 56.94,67.73 40.69,67.73 R68.2
1280-SCK  (via drill 0.51)
  Top 0.254: ICSP2.3 43.18,50.16 43.18,52.07 43.81,52.7 57.78,52.7 58.42,53.34 58.42,58.42 59.69,59.69 62.23,59.69 63.19,58.73 U4.20 75.25,58.73 75.26,58.74 75.88,58.74 76.52,59.37 v76.52,60.01 | SCK.TP v10.16,99.69 12.06,97.79 19.32,97.79 R31.2 | v34.29,77.47 41.91,69.85 46.35,69.85 v46.99,69.22
  Bottom 0.254: v46.99,69.22 48.9,67.31 48.9,50.8 48.26,50.16 45.72,50.16 ICSP2.3 | v76.52,60.01 82.23,60.01 95.25,46.99 126.05,46.99 130.49,51.44 132.72,51.44 INTERFACE.18 | v10.16,99.69 10.79,99.69 21.59,88.9 26.04,88.9 34.29,80.64 v34.29,77.47
1280-TX
  Top 0.254: U4.3 71.2,67.23 69.22,69.22 59.69,69.22 57.7,67.23 42.09,67.23 R71.2
+24V  (via drill 1.27 pad 3.81)
  Top 0.813: R80.2 TP35.TP 38.1,34.92 36.83,36.2 31.75,36.2 30.48,34.92 30.48,27.46 30.56,27.38 | R98.2 55.3,9.47 EX1.3 | R100.2 95.94,9.47 EX2.3 | R101.2 111.18,9.47 HBP.1 | R102.2 126.42,9.47 EXTRA.1 | C33.1 25.77,6.62 26.04,6.35
  Top 1.27: 25.4,22.23 U13.3 | 25.4,22.23 30.56,27.38 U14.1 | 25.4,22.23 22.23,22.23 19.68,19.68
  Top 1.676: U6.6 38.73,20.95 38.73,15.88 | 37.47,5.71 38.1,5.71 38.73,6.35 38.73,15.88 | 38.73,15.88 U6.4 | U7.6 79.38,20.95 79.38,15.88 U7.4 82.89,3.09 83.19,2.79
  Top 1.778: BOTSTEP-X.8 74.32,87 C10.1 | BOTSTEP-Y.8 92.1,87 C11.1 | BOTSTEP-Z.8 109.88,87 C12.1 | BOTSTEP-A.8 127.66,87 C13.1 | BOTSTEP-B.8 145.44,87 C14.1
  Top 4.064: 57.15,2.79 40.32,2.79 37.47,5.71 36.83,6.35 C34.+ 26.04,6.35 23.5,6.35 20.95,8.89 20.95,18.41 19.68,19.68 19.05,20.32 14.02,20.32 PWR2.1A | 57.15,2.79 83.19,2.79 97.79,2.79 | 97.79,2.79 113.03,2.79 | 113.03,2.79 128.27,2.79 | 57.15,2.79 EX1.3 | 97.79,2.79 EX2.3 | 113.03,2.79 HBP.1 | 128.27,2.79 EXTRA.1 | 128.27,2.79 143.45,2.79 143.51,2.86 143.51,11.75 141.76,13.49 141.45,13.49 141.29,13.65 v141.29,18.1
  Bottom 1.778: 138.43,23.18 RGB-LED.1
  Bottom 2.54: 76.2,82.55 BOTSTEP-X.8 | 93.98,82.55 BOTSTEP-Y.8 | 111.76,82.55 BOTSTEP-Z.8 | BOTSTEP-A.8 129.54,83.19 130.18,82.55 | 147.32,82.55 BOTSTEP-B.8
  Bottom 4.064: 141.29,23.18 149.86,23.18 149.86,82.55 147.32,82.55 130.18,82.55 111.76,82.55 93.98,82.55 76.2,82.55 | 141.29,23.18 v141.29,18.1 141.29,13.65 141.6,13.65 143.51,11.75 CS-FAN.1 143.51,2.86 v138.43,2.86 | 141.29,23.18 138.43,23.18
A-AXIS-DIR  (via drill 0.51)
  Top 0.254: U4.76 86.64,71.41 87.63,72.39 93.34,72.39 99.69,78.74 102.23,78.74 105.41,81.92 113.03,81.92 | 113.03,81.92 A-DIR.TP | BOTSTEP-A.16 113.67,101.6 v113.67,95.25 | v113.67,90.81 113.67,82.55 113.03,81.92
  Bottom 0.254: v113.67,90.81 v113.67,95.25
A-AXIS-EN  (via drill 0.51)
  Top 0.254: U4.74 91.22,67.73 100.97,77.47 103.5,77.47 106.05,80.01 118.75,80.01 120.65,81.92 120.65,83.82 120.02,84.45 A-EN.TP BOTSTEP-A.9
  Top 0.406: R42.1 126.36,92.08 v122.56,88.27
  Bottom 0.406: v122.56,88.27 121.28,87 BOTSTEP-A.9
A-AXIS-POT
  Top 0.254: U4.73 92,67.23 101.6,76.83 104.14,76.83 106.68,79.38 119.11,79.38 R106.2
A-AXIS-STEP  (via drill 0.51)
  Top 0.254: U4.75 90.45,68.23 100.33,78.11 102.87,78.11 105.41,80.64 117.47,80.64 118.11,81.28 118.11,82.55 117.47,83.19 A-STEP.TP 116.2,83.19 114.94,84.45 v114.94,88.27 | BOTSTEP-A.15 114.94,100.33 v114.94,95.89
  Bottom 0.254: v114.94,88.27 v114.94,95.89
APWR1
  Top 0.762: 62.23,13.34 FET2.C
  Top 3.048: EX1.4 62.23,13.34 62.23,18.68 Q2.MB
AREF
  Top 0.254: U4.98 75.64,72.31 75.56,72.39 73.92,72.39 C19.1
B-AXIS-DIR  (via drill 0.51)
  Top 0.254: U4.72 92.77,66.73 102.23,76.2 104.78,76.2 107.31,78.74 125.09,78.74 128.27,81.92 130.81,81.92 | 130.81,81.92 B-DIR.TP | BOTSTEP-B.16 131.44,101.6 v131.44,95.25 | v131.44,90.81 131.44,82.55 130.81,81.92
  Bottom 0.254: v131.44,90.81 v131.44,95.25
B-AXIS-EN  (via drill 0.51)
  Top 0.254: U4.70 94.31,65.73 103.5,74.93 106.05,74.93 108.58,77.47 126.36,77.47 128.91,80.01 135.89,80.01 138.43,82.55 138.43,83.82 137.79,84.45 B-EN.TP BOTSTEP-B.9
  Top 0.406: v140.34,88.27 144.15,92.08 R43.1
  Bottom 0.406: BOTSTEP-B.9 139.06,87 v140.34,88.27
B-AXIS-POT
  Top 0.254: U4.69 95.08,65.23 104.14,74.3 106.68,74.3 109.22,76.83 127,76.83 129.54,79.38 136.9,79.38 R107.2
B-AXIS-STEP  (via drill 0.51)
  Top 0.254: U4.71 93.53,66.23 102.87,75.56 105.41,75.56 107.95,78.11 125.73,78.11 128.27,80.64 135.25,80.64 135.89,81.28 135.89,82.55 135.25,83.19 B-STEP.TP 133.99,83.19 132.72,84.45 v132.72,88.27 | BOTSTEP-B.15 132.72,100.33 v132.72,95.89
  Bottom 0.254: v132.72,88.27 v132.72,95.89
BLINK
  Top 0.254: U4.26 74.64,56.83 78.42,56.83 78.74,57.15 78.74,66.67 | DEBUG1.A 2.17,112.39 1.27,112.39 0.64,111.76 0.64,100.33 1.27,99.69 1.27,91.44 8.26,84.45 14.61,84.45 17.78,81.28 24.13,81.28 24.77,81.92 33.02,81.92 43.81,71.12 71.75,71.12 76.2,66.67 78.74,66.67 | JP4.5 97.16,50.16 93.34,53.98 88.9,53.98 80.64,62.23 80.64,65.41 79.38,66.67 78.74,66.67
BPWR
  Top 0.762: 92.71,13.34 FET3.C
  Top 3.048: EX2.2 92.71,13.34 92.71,20.59 Q3.MB
BPWR1
  Top 0.762: 102.87,13.34 FET4.C
  Top 3.048: EX2.4 102.87,13.34 102.87,18.68 Q4.MB
BUZZ  (via drill 0.51)
  Top 0.254: v54.61,69.22 55.59,68.23 56.16,68.23 58.42,70.48 69.85,70.48 72.11,68.23 U4.1
  Bottom 0.254: v54.61,69.22 LS1.+
CPWR
  Top 0.762: 118.11,13.34 FET5.C
  Top 3.048: HBP.2 118.11,13.34 118.11,18.68 Q5.MB
CUTOFF-RESET  (via drill 0.51)
  Top 0.254: U5.1 69.22,19.25 69.22,21.22 R93.2 68.58,22.59 v68.58,24.77 | v68.58,62.87 69.22,62.23 U4.13 | v71.75,45.09 71.75,41.91 v70.48,40.64
  Bottom 0.254: v70.48,40.64 70.48,26.67 v68.58,24.77 | v71.75,45.09 71.75,52.07 72.39,52.7 72.39,60.33 69.85,62.87 v68.58,62.87
CUTOFF-SR-CHECK  (via drill 0.51)
  Top 0.254: U5.7 U5.6 | U5.7 74.86,18.66 U7.2 | U5.7 70.87,18.66 70.48,19.05 v70.48,24.77 | 66.67,25.4 65.41,25.4 60.33,30.48 44.45,30.48 36.2,22.23 36.2,19.05 35.56,18.41 U6.2 | 66.67,25.4 67.31,25.4 67.94,26.04 69.22,26.04 v70.48,24.77 | U4.29 76.14,53.28 v74.3,51.44 | v70.48,24.77 73.03,27.3 R91.1 | 66.67,25.4 R86.1
  Bottom 0.254: v74.3,51.44 74.93,52.07 76.2,52.07 76.83,51.44 76.83,46.35 71.75,41.27 71.75,26.04 v70.48,24.77
CUTOFF-TEST  (via drill 0.51)
  Top 0.254: 72.66,15.24 R96.1 | 72.66,15.24 72.66,16.84 U5.5 | 72.66,15.24 72.02,15.88 69.22,15.88 67.58,17.52 R95.1 66.04,18.79 v66.04,24.13 | U4.12 71.25,62.73 69.85,64.14 v66.67,64.14 | v62.23,41.91 v62.23,44.45
  Bottom 0.254: v62.23,44.45 63.5,44.45 64.14,43.81 68.9,43.81 69.22,44.13 69.22,50.48 71.75,53.02 71.75,59.69 69.85,61.59 67.94,61.59 66.67,62.87 v66.67,64.14 | v62.23,41.91 62.23,27.94 v66.04,24.13
DATA+  (via drill 0.51)
  Top 0.254: v14.61,69.22 14.61,68.39 14.38,68.17
  Top 0.61: v22.23,60.64 20.37,60.64 VR2.2 | X2.3 14.38,68.17 14.48,68.26 16.51,68.26 17.14,67.63 R66.2
  Bottom 0.254: USB+.TP 5.08,69.85 8.89,73.66 12.06,73.66 14.61,71.12 v14.61,69.22
  Bottom 0.61: X2.3 12.68,66.66 10.16,64.14 10.16,62.55 11.43,61.28 21.59,61.28 v22.23,60.64
DATA-  (via drill 0.51)
  Top 0.254: v8.89,68.58 v12.06,68.58
  Top 0.61: X2.2 14.87,66.46 17.65,63.69 | 17.65,63.69 R69.2 | 20.05,70.44 VR1.2 21.27,69.26 v21.27,69.22 | 17.65,63.69 18.41,64.45 20.32,64.45 v21.27,65.41
  Bottom 0.254: USB-.TP 7.62,67.31 v8.89,68.58 | v12.06,68.58 12.95,68.58 X2.2
  Bottom 0.61: v21.27,65.41 v21.27,69.22
DPWR
  Top 0.762: 133.35,13.34 FET6.C
  Top 3.048: EXTRA.2 133.35,13.34 133.35,18.68 Q6.MB
DTR
  Top 0.254: U3.13 32,65.66 32.7,66.36 34.02,66.36 34.66,66.99 C20.2
EX1-FAN  (via drill 0.51)
  Top 0.254: U4.16 66.52,60.73 v66.42,60.83 | Q2.4 59.32,23.34 R89.2 60.33,25.4 v60.96,26.04 | v60.33,41.91 v60.33,44.45
  Bottom 0.254: v60.96,26.04 60.96,41.27 v60.33,41.91 | v60.33,44.45 60.33,52.07 66.42,58.17 v66.42,60.83
EX1-HEAT  (via drill 0.51)
  Top 0.254: Q1.4 48.59,25.88 R82.2 48.59,28.9 48.9,29.21 v49.53,29.21 | v51.44,44.45 48.9,41.91 v48.9,40.64 | U4.15 67.67,61.23 66.67,62.23 v64.14,62.23
  Bottom 0.254: v64.14,62.23 63.5,62.23 62.23,60.96 62.23,59.05 62.87,58.42 62.87,55.88 v51.44,44.45 | v49.53,29.21 49.53,40.01 v48.9,40.64
EX1-PWR
  Top 0.813: 44.45,13.34 R97.2 | R92.2 44.45,18.41 44.13,18.1
  Top 1.676: U6.5 43.81,18.41 44.13,18.1 44.45,17.78 44.45,13.34 44.45,10.16 EX1.1
EX1-PWR-CHECK  (via drill 0.51)
  Top 0.254: v64.14,64.14 64.77,64.14 66.04,62.87 66.67,62.87 67.81,61.73 U4.14 | 44.45,24.13 v41.91,24.13
  Top 0.762: R92.1 44.45,24.13 R87.2
  Bottom 0.254: v64.14,64.14 62.87,64.14 61.59,62.87 61.59,59.05 62.23,58.42 62.23,56.52 53.34,47.62 43.81,47.62 43.18,46.99 43.18,27.3 41.91,26.04 v41.91,24.13
EX2-FAN
  Top 0.254: Q4.4 99.96,23.34 R90.2 99.96,29.58 95.25,34.29 91.44,34.29 86.36,39.37 55.88,39.37 54.61,40.64 54.61,43.18 60.96,49.53 60.96,55.24 61.95,56.23 U4.25
EX2-HEAT
  Top 0.254: Q3.4 89.17,25.88 R83.2 89.17,34.02 86.36,36.83 56.52,36.83 53.98,39.37 53.98,43.81 60.33,50.16 60.33,55.88 61.17,56.73 U4.24
EX2-PWR
  Top 0.813: 85.09,13.34 R99.2 | R94.2 85.09,18.41 84.77,18.1
  Top 1.676: U7.5 84.45,18.41 84.77,18.1 85.09,17.78 85.09,13.34 85.09,10.16 EX2.1
EX2-PWR-CHECK  (via drill 0.51)
  Top 0.254: U4.23 73.96,57.23 74.04,57.15 74.04,55.88 73.66,55.24 v73.66,52.7 | v81.28,25.4 84.83,25.4 R88.2
  Top 0.762: R94.1 R88.2
  Bottom 0.254: v73.66,52.7 79.38,52.7 80.64,51.44 80.64,26.04 v81.28,25.4
EXTRA-FET
  Top 0.254: U4.40 81.64,52.34 90.17,43.81 90.17,40.64 91.44,39.37 113.67,39.37 115.07,37.96 115.07,31.61 117.47,29.21 125.09,29.21 125.87,28.44 R85.2 126,27.3 127.64,27.3 128.27,26.67 Q6.4
GND  (via drill 0.51)
  Top 0.254: U3.EXP 27.19,64.66 U3.3 27.19,62.03 28.89,60.33 C23.1 | U4.11 74.91,63.23 v75.56,63.88 | U4.99 75.14,69 75.56,68.58 76.07,68.58 76.45,68.96 78.36,68.96 v79.38,67.94 | U4.62 87.5,61.73 86.36,62.87 v86.36,67.94 85.72,68.58 84.45,68.58 84.14,68.89 U4.81 | v81.92,56.52 81.15,55.75 77.98,55.75 77.64,55.42 U4.32 77.64,49.7 76.83,48.9 76.2,48.9
  Top 0.61: U14.2 34.29,25.45 C32.2
  other vias: 17.78,55.24 64.64,65.66 65.41,48.9 110.49,62.23 115.57,62.23 120.65,62.23 65.41,55.24 69.22,54.61 67.31,72.39 88.27,70.48 90.81,70.48 74.93,66.04 133.99,25.4 113.98,27.94 115.89,27.94 117.79,27.94 119.7,27.94 101.6,25.4 103.5,25.4 105.41,25.4 106.05,23.5 90.81,27.94 92.71,27.94 94.61,27.94 95.25,26.04 62.23,24.77 63.5,24.77 50.16,27.94 52.07,27.94 53.98,27.94 54.61,26.04 46.35,26.42 70.48,17.14 90.81,74.3 94.11,77.09 61.59,46.99 55.63,42.16 19.68,53.34 32.38,58.42 23.24,70.74 14.61,90.17 19.68,87 29.21,91.44 6.86,98.81 52.7,50.8 82.55,45.72 97.79,41.27 116.2,44.45 118.43,26.04 120.33,26.04 121.6,27.94 122.24,26.04 21.91,53.34 37.15,57.15 40.32,55.24 34.29,52.39 64.45,50.8 66.36,50.8 64.14,41.91 64.45,46.67 67.94,45.09 70.48,44.45 68.9,41.91 68.9,27.62 63.5,29.53 135.89,48.9 135.89,46.35 135.89,43.81 139.7,31.11 143.51,31.11 7.62,107 10.79,107 69.98,86.61 87.76,86.61 105.54,86.61 123.32,86.61 141.1,86.61 135.57,26.67 135.89,24.77
  pour Bottom: 50.8,95.25 50.8,119.38 153.67,119.38 153.67,-0.64 -1.27,-1.27 -0.64,119.38 26.67,119.38 26.67,95.25
  pour Top: -0.64,119.38 -1.27,-1.27 153.67,-0.64 153.67,119.38 50.8,119.38 50.8,95.25 26.67,95.25 26.67,119.38
HBP
  Top 0.254: U4.39 81.14,52.2 89.53,43.81 89.53,38.73 91.44,36.83 110.49,36.83 112.66,34.66 R84.2 112.66,27.15 Q5.4
HBP-THERM  (via drill 0.51)
  Top 0.254: v104.9,72.01 TP27.TP R65.2 108.32,72.76 109.22,73.66 112.65,73.66 HBP-THERM.4 | U4.82 83.64,68.12 v84.14,67.63
  Bottom 0.254: v104.9,72.01 87.88,72.01 84.14,68.26 v84.14,67.63
I4-UP
  Top 0.254: U4.67 97.25,64.23 99.06,66.04 124.46,66.04 127.64,69.22 132.72,69.22 INTERFACE.4
I5-DOWN
  Top 0.254: U4.66 98.02,63.73 99.69,65.41 125.09,65.41 127.64,67.94 INTERFACE.5
I6-LEFT
  Top 0.254: U4.65 98.79,63.23 100.33,64.77 125.09,64.77 127,66.67 132.72,66.67 INTERFACE.6
I7-RIGHT
  Top 0.254: U4.64 99.56,62.73 100.97,64.14 125.09,64.14 126.36,65.41 INTERFACE.7
I8-CENTER
  Top 0.254: U4.63 100.33,62.23 101.6,63.5 125.09,63.5 125.73,64.14 132.72,64.14 INTERFACE.8
I9-DETECT
  Top 0.254: INTERFACE.9 127.33,62.87 R70.2 126.36,61.9 126.36,61.59 125.5,60.73 U4.60
I10-GLED
  Top 0.254: INTERFACE.10 132.72,61.59 128.27,61.59 126.91,60.23 U4.59
I11-RLED
  Top 0.254: U4.58 127.67,59.73 128.27,60.33 INTERFACE.11
I12-LCD-STROBE
  Top 0.254: INTERFACE.12 132.72,59.05 127.64,59.05 127.46,59.23 U4.57
I13-LCD-DATA
  Top 0.254: U4.56 126.69,58.73 127.64,57.78 INTERFACE.13
I14-LCD-CLK
  Top 0.254: U4.55 125.92,58.23 127.64,56.52 132.72,56.52 INTERFACE.14
M8RXD
  Top 0.254: 34.51,63.66 R68.1 34.02,62.87 32.07,62.87 31.28,63.66 U3.9
M8TXD
  Top 0.254: U3.8 29.69,62.7 30.16,62.23 34.02,62.23 R71.1
N$1
  Top 0.813: R81.2 3.3V.A
N$2
  Top 0.254: U4.34 78.64,48.16 78.11,47.62 63.23,47.62 C28.2 61.97,51.36 Y2.1
N$3
  Top 0.813: R79.2 5V.A
N$4
  Top 0.406: R76.2 DEBUG4.C
N$5
  Top 0.406: R52.1 R51.2 44.72,93.34 43.81,93.34 43.18,93.98 U2.6
N$6
  Top 0.254: R1.2 DEBUG1.C
N$7
  Top 0.406: X1.4 32.76,110.75 C1.1 33.02,106.42 U1.3
N$8
  Top 0.813: R98.1 FET2.A
N$9
  Top 0.813: R100.1 FET4.A
N$10
  Top 0.813: R80.1 24V.A
N$11
  Top 0.406: R50.2 R49.1 U2.5
N$12
  Top 0.813: R102.1 FET6.A
N$13
  Top 0.254: U4.33 78.14,48.94 77.47,48.26 69.48,48.26 C29.2 68.84,51.36 Y2.2
N$14
  Top 0.406: DEBUG2.C R74.2
N$15
  Top 0.406: R75.2 DEBUG3.C
N$16
  Top 0.406: C2.2 44.72,110.75 X1.1 | U2.2 44.45,106.42 C2.2 | R3.1 44.98,106.94 C2.2
N$17
  Top 0.813: R101.1 FET5.A
N$18  (via drill 0.51)
  Top 0.406: R5.1 R20.2 71.39,98.69 70.48,97.79 67.31,97.79 v66.67,97.16
  Bottom 0.406: v66.67,97.16 66.67,93.98 69.22,91.44 69.22,90.17 68.58,89.53 BOTSTEP-X.10
N$19  (via drill 0.6 pad 0)
  other vias: 88.9,22.86
N$20  (via drill 0.6 pad 0)
  other vias: 87.63,21.59
N$21  (via drill 0.6 pad 0)
  other vias: 87.63,22.86
N$22
  Top 0.406: C1.2 34.55,110.75 X1.3 | U1.2 34.29,106.42 C1.2 | R2.1 34.82,106.94 C1.2
N$23  (via drill 0.6 pad 0)
  other vias: 88.9,21.59
N$24  (via drill 0.51)
  other vias: 113.67,19.68
N$25  (via drill 0.6 pad 0)
  other vias: 87.63,20.32
N$26  (via drill 0.6 pad 0)
  other vias: 88.9,20.32
N$27  (via drill 0.51)
  Top 0.406: U2.4 41.8,102.18 C9.2 37.73,102.18 v37.47,101.92 | 31.48,87.89 R60.2 R59.2 29.84,88.9 30.48,89.53 30.48,98.42 31.11,99.06 v37.47,99.06
  Bottom 0.406: v37.47,99.06 v37.47,101.92
N$28
  Top 0.254: R96.2 70.86,9.15 CUTOFF.1
N$29  (via drill 0.6 pad 0)
  other vias: 87.63,17.78
N$30  (via drill 0.6 pad 0)
  other vias: 87.63,19.05
N$31  (via drill 0.6 pad 0)
  other vias: 88.9,16.51
N$32  (via drill 0.6 pad 0)
  other vias: 87.63,16.51
N$33  (via drill 0.6 pad 0)
  other vias: 88.9,17.78
N$34
  Top 0.406: U2.7 44.45,95.25 46.35,93.34 48.52,93.34 R53.2
N$35  (via drill 0.51)
  other vias: 17.14,41.91
N$36
  Top 0.406: U1.7 34.29,95.25 36.2,93.34 38.37,93.34 R48.2
N$37
  Top 0.406: BOTSTEP-X.13 BOTSTEP-X.14 65.67,99.69 R7.1
N$38  (via drill 0.6 pad 0)
  other vias: 88.9,19.05
N$39  (via drill 0.6 pad 0)
  other vias: 90.17,17.78
N$40  (via drill 0.6 pad 0)
  other vias: 90.17,16.51
N$41
  Top 0.813: R97.1 FET1.A
N$42
  Top 0.813: R99.1 FET3.A
N$43  (via drill 0.6 pad 0)
  other vias: 91.44,16.51
N$44  (via drill 0.6 pad 0)
  other vias: 91.44,17.78
N$45  (via drill 0.6 pad 0)
  other vias: 92.71,16.51
N$46  (via drill 0.6 pad 0)
  other vias: 92.71,17.78
N$47  (via drill 0.6 pad 0)
  other vias: 90.17,19.05
N$48  (via drill 0.6 pad 0)
  other vias: 91.44,19.05
N$49  (via drill 0.6 pad 0)
  other vias: 92.71,19.05
N$50  (via drill 0.6 pad 0)
  other vias: 93.98,16.51
N$51  (via drill 0.6 pad 0)
  other vias: 93.98,17.78
N$52  (via drill 0.6 pad 0)
  other vias: 95.25,16.51
N$53  (via drill 0.6 pad 0)
  other vias: 95.25,17.78
N$54  (via drill 0.6 pad 0)
  other vias: 93.98,19.05
N$55  (via drill 0.6 pad 0)
  other vias: 95.25,19.05
N$56
  Top 0.406: X1.2 42.91,110.75 C2.1 43.18,106.42 U2.3
N$57  (via drill 0.6 pad 0)
  other vias: 93.98,20.32
N$58  (via drill 0.6 pad 0)
  other vias: 95.25,20.32
N$59  (via drill 0.6 pad 0)
  other vias: 93.98,21.59
N$60  (via drill 0.6 pad 0)
  other vias: 95.25,21.59
N$61  (via drill 0.6 pad 0)
  other vias: 93.98,22.86
N$62  (via drill 0.6 pad 0)
  other vias: 95.25,22.86
N$63  (via drill 0.6 pad 0)
  other vias: 112.39,22.23
N$64  (via drill 0.6 pad 0)
  other vias: 112.39,20.95
N$65  (via drill 0.6 pad 0)
  other vias: 111.12,22.23
N$66  (via drill 0.6 pad 0)
  other vias: 111.12,20.95
N$67  (via drill 0.6 pad 0)
  other vias: 112.39,19.68
N$68  (via drill 0.6 pad 0)
  other vias: 111.12,19.68
N$69  (via drill 0.6 pad 0)
  other vias: 111.12,18.41
N$70  (via drill 0.6 pad 0)
  other vias: 111.12,15.88
N$71  (via drill 0.6 pad 0)
  other vias: 111.12,17.14
N$72  (via drill 0.6 pad 0)
  other vias: 112.39,15.88
N$73  (via drill 0.6 pad 0)
  other vias: 112.39,17.14
N$74  (via drill 0.6 pad 0)
  other vias: 113.67,15.88
N$75  (via drill 0.6 pad 0)
  other vias: 113.67,17.14
N$76  (via drill 0.6 pad 0)
  other vias: 112.39,18.41
N$77  (via drill 0.6 pad 0)
  other vias: 113.67,18.41
N$78  (via drill 0.6 pad 0)
  other vias: 114.94,18.41
N$79  (via drill 0.6 pad 0)
  other vias: 116.2,17.14
N$80  (via drill 0.6 pad 0)
  other vias: 114.94,17.14
N$81  (via drill 0.6 pad 0)
  other vias: 114.94,15.88
N$82  (via drill 0.6 pad 0)
  other vias: 116.2,15.88
N$83  (via drill 0.6 pad 0)
  other vias: 117.47,15.88
N$84  (via drill 0.6 pad 0)
  other vias: 117.47,17.14
N$85  (via drill 0.6 pad 0)
  other vias: 118.75,15.88
N$86  (via drill 0.6 pad 0)
  other vias: 116.2,18.41
N$87  (via drill 0.6 pad 0)
  other vias: 118.75,17.14
N$88  (via drill 0.6 pad 0)
  other vias: 117.47,18.41
N$89  (via drill 0.6 pad 0)
  other vias: 118.75,18.41
N$90  (via drill 0.6 pad 0)
  other vias: 117.47,19.68
N$91  (via drill 0.6 pad 0)
  other vias: 118.75,19.68
N$92  (via drill 0.6 pad 0)
  other vias: 117.47,20.95
N$93  (via drill 0.6 pad 0)
  other vias: 118.75,20.95
N$94  (via drill 0.6 pad 0)
  other vias: 117.47,22.23
N$95  (via drill 0.6 pad 0)
  other vias: 118.75,22.23
N$96  (via drill 0.51)
  Top 0.406: v67.31,90.81 U8.5
  Bottom 0.406: v67.31,90.81 62.87,90.81 62.23,91.44 62.23,93.34 BOTSTEP-X.12
N$97  (via drill 0.51)
  other vias: 127.64,22.86
N$98
  Top 0.406: R34.1 68.16,92.44 U8.6
N$99  (via drill 0.51)
  other vias: 127.64,21.59
N$100  (via drill 0.51)
  Top 0.406: R6.1 R21.2 65.67,98.69 v65.41,98.42
  Bottom 0.406: v65.41,98.42 65.41,93.98 BOTSTEP-X.11
N$101  (via drill 0.51)
  other vias: 127.64,20.32
N$102
  Top 0.406: R10.1 83.45,99.69 BOTSTEP-Y.14 BOTSTEP-Y.13
N$103  (via drill 0.51)
  other vias: 127.64,19.05
N$104
  Bottom 1.778: X-STEPPER.2 71.83,104.06 75.56,99.69 BOTSTEP-X.3
N$105
  Bottom 1.778: X-STEPPER.1 75.79,109 78.74,106.05 78.74,98.42 77.47,97.16 BOTSTEP-X.4
N$106
  Bottom 1.778: X-STEPPER.3 67.87,108.66 69.22,107.31 69.22,102.23 73.66,97.79 73.66,96.52 75.56,94.61 BOTSTEP-X.5
N$107
  Bottom 1.778: BOTSTEP-X.6 74.93,92.08 66.67,100.33 66.67,106.05 63.91,108.81 X-STEPPER.4
N$108
  Top 0.254: R91.2 OVERHEAT.A
N$109
  Bottom 4.064: PWR1.4 10.56,32.42 PWR1.2 11.23,31.75 14.92,31.75 19.05,27.62 19.05,17.14 15.24,13.34 PWR2.1
N$110  (via drill 0.51)
  other vias: 128.91,19.05
N$111  (via drill 0.51)
  Top 0.406: v85.09,90.81 U9.5
  Bottom 0.406: v85.09,90.81 80.64,90.81 80.01,91.44 80.01,93.34 BOTSTEP-Y.12
N$112
  Top 0.406: R35.1 85.94,92.44 U9.6
N$113  (via drill 0.51)
  other vias: 130.18,19.05
N$114  (via drill 0.51)
  Top 0.406: R9.1 R23.2 83.45,98.69 v83.19,98.42
  Bottom 0.406: v83.19,98.42 83.19,93.98 BOTSTEP-Y.11
N$115
  Bottom 1.778: Y-STEPPER.2 89.61,103.43 93.34,99.69 BOTSTEP-Y.3
N$116  (via drill 0.51)
  other vias: 131.44,19.05
N$117
  Bottom 1.778: Y-STEPPER.1 93.57,109 96.52,106.05 96.52,98.42 95.25,97.16 BOTSTEP-Y.4
N$118
  Bottom 1.778: Y-STEPPER.3 85.65,108.66 87,107.31 87,102.23 91.44,97.79 91.44,96.52 93.34,94.61 BOTSTEP-Y.5
N$119  (via drill 0.51)
  other vias: 132.72,19.05
N$120
  Bottom 1.778: Y-STEPPER.4 81.69,108.81 84.45,106.05 84.45,100.33 92.71,92.08 BOTSTEP-Y.6
N$121  (via drill 0.51)
  Top 0.406: R8.1 R22.2 89.17,98.69 88.27,97.79 85.09,97.79 v84.45,97.16
  Bottom 0.406: v84.45,97.16 84.45,93.98 87,91.44 87,90.17 86.36,89.53 BOTSTEP-Y.10
N$122
  Top 0.406: BOTSTEP-Z.13 BOTSTEP-Z.14 101.23,99.69 R13.1
N$123  (via drill 0.51)
  other vias: 132.72,20.32
N$124  (via drill 0.51)
  Top 0.406: v102.87,90.81 U10.5
  Bottom 0.406: BOTSTEP-Z.12 97.79,93.34 97.79,91.44 98.42,90.81 v102.87,90.81
N$125  (via drill 0.51)
  other vias: 132.72,21.59
N$126
  Top 0.406: R36.1 103.72,92.44 U10.6
N$127  (via drill 0.51)
  other vias: 132.72,22.86
N$128  (via drill 0.6 pad 0)
  other vias: 48.32,22.86
N$129  (via drill 0.6 pad 0)
  other vias: 48.32,21.59
N$130  (via drill 0.6 pad 0)
  other vias: 47.05,22.86
N$131  (via drill 0.6 pad 0)
  other vias: 47.05,21.59
N$132  (via drill 0.6 pad 0)
  other vias: 48.32,20.32
N$133  (via drill 0.6 pad 0)
  other vias: 47.05,20.32
N$134  (via drill 0.6 pad 0)
  other vias: 47.05,17.78
N$135  (via drill 0.6 pad 0)
  other vias: 48.32,19.05
N$136  (via drill 0.6 pad 0)
  other vias: 49.59,16.51
N$137  (via drill 0.6 pad 0)
  other vias: 49.59,19.05
N$138  (via drill 0.6 pad 0)
  other vias: 47.05,19.05
N$139  (via drill 0.6 pad 0)
  other vias: 48.32,17.78
N$140  (via drill 0.6 pad 0)
  other vias: 49.59,17.78
N$141  (via drill 0.6 pad 0)
  other vias: 47.05,16.51
N$142  (via drill 0.6 pad 0)
  other vias: 48.32,16.51
N$143  (via drill 0.6 pad 0)
  other vias: 50.86,17.78
N$144  (via drill 0.6 pad 0)
  other vias: 50.86,19.05
N$145  (via drill 0.6 pad 0)
  other vias: 52.13,16.51
N$146  (via drill 0.6 pad 0)
  other vias: 52.13,17.78
N$147  (via drill 0.6 pad 0)
  other vias: 53.4,16.51
N$148  (via drill 0.6 pad 0)
  other vias: 50.86,16.51
N$149  (via drill 0.6 pad 0)
  other vias: 53.4,17.78 53.4,17.78
N$150  (via drill 0.6 pad 0)
  other vias: 54.67,17.78
N$151  (via drill 0.6 pad 0)
  other vias: 54.67,16.51
N$152  (via drill 0.6 pad 0)
  other vias: 54.67,19.05
N$153  (via drill 0.6 pad 0)
  other vias: 52.13,19.05
N$154  (via drill 0.6 pad 0)
  other vias: 53.4,19.05
N$155  (via drill 0.6 pad 0)
  other vias: 53.4,20.32
N$156  (via drill 0.6 pad 0)
  other vias: 54.67,20.32
N$157  (via drill 0.6 pad 0)
  other vias: 54.67,21.59
N$158  (via drill 0.6 pad 0)
  other vias: 53.4,21.59
N$159  (via drill 0.6 pad 0)
  other vias: 53.4,22.86
N$160  (via drill 0.6 pad 0)
  other vias: 54.67,22.86
N$161  (via drill 0.51)
  Top 0.406: R12.1 R25.2 101.23,98.69 v100.97,98.42
  Bottom 0.406: v100.97,98.42 100.97,93.98 BOTSTEP-Z.11
N$162
  Bottom 1.778: Z-STEPPER.2 107.39,103.43 111.12,99.69 BOTSTEP-Z.3
N$163
  Bottom 1.778: Z-STEPPER.1 111.35,109 114.3,106.05 114.3,98.42 113.03,97.16 BOTSTEP-Z.4
N$164